# EAGLE design Wiegand_RF (EAGLE 7.2.0)
Assembly variants: minimal
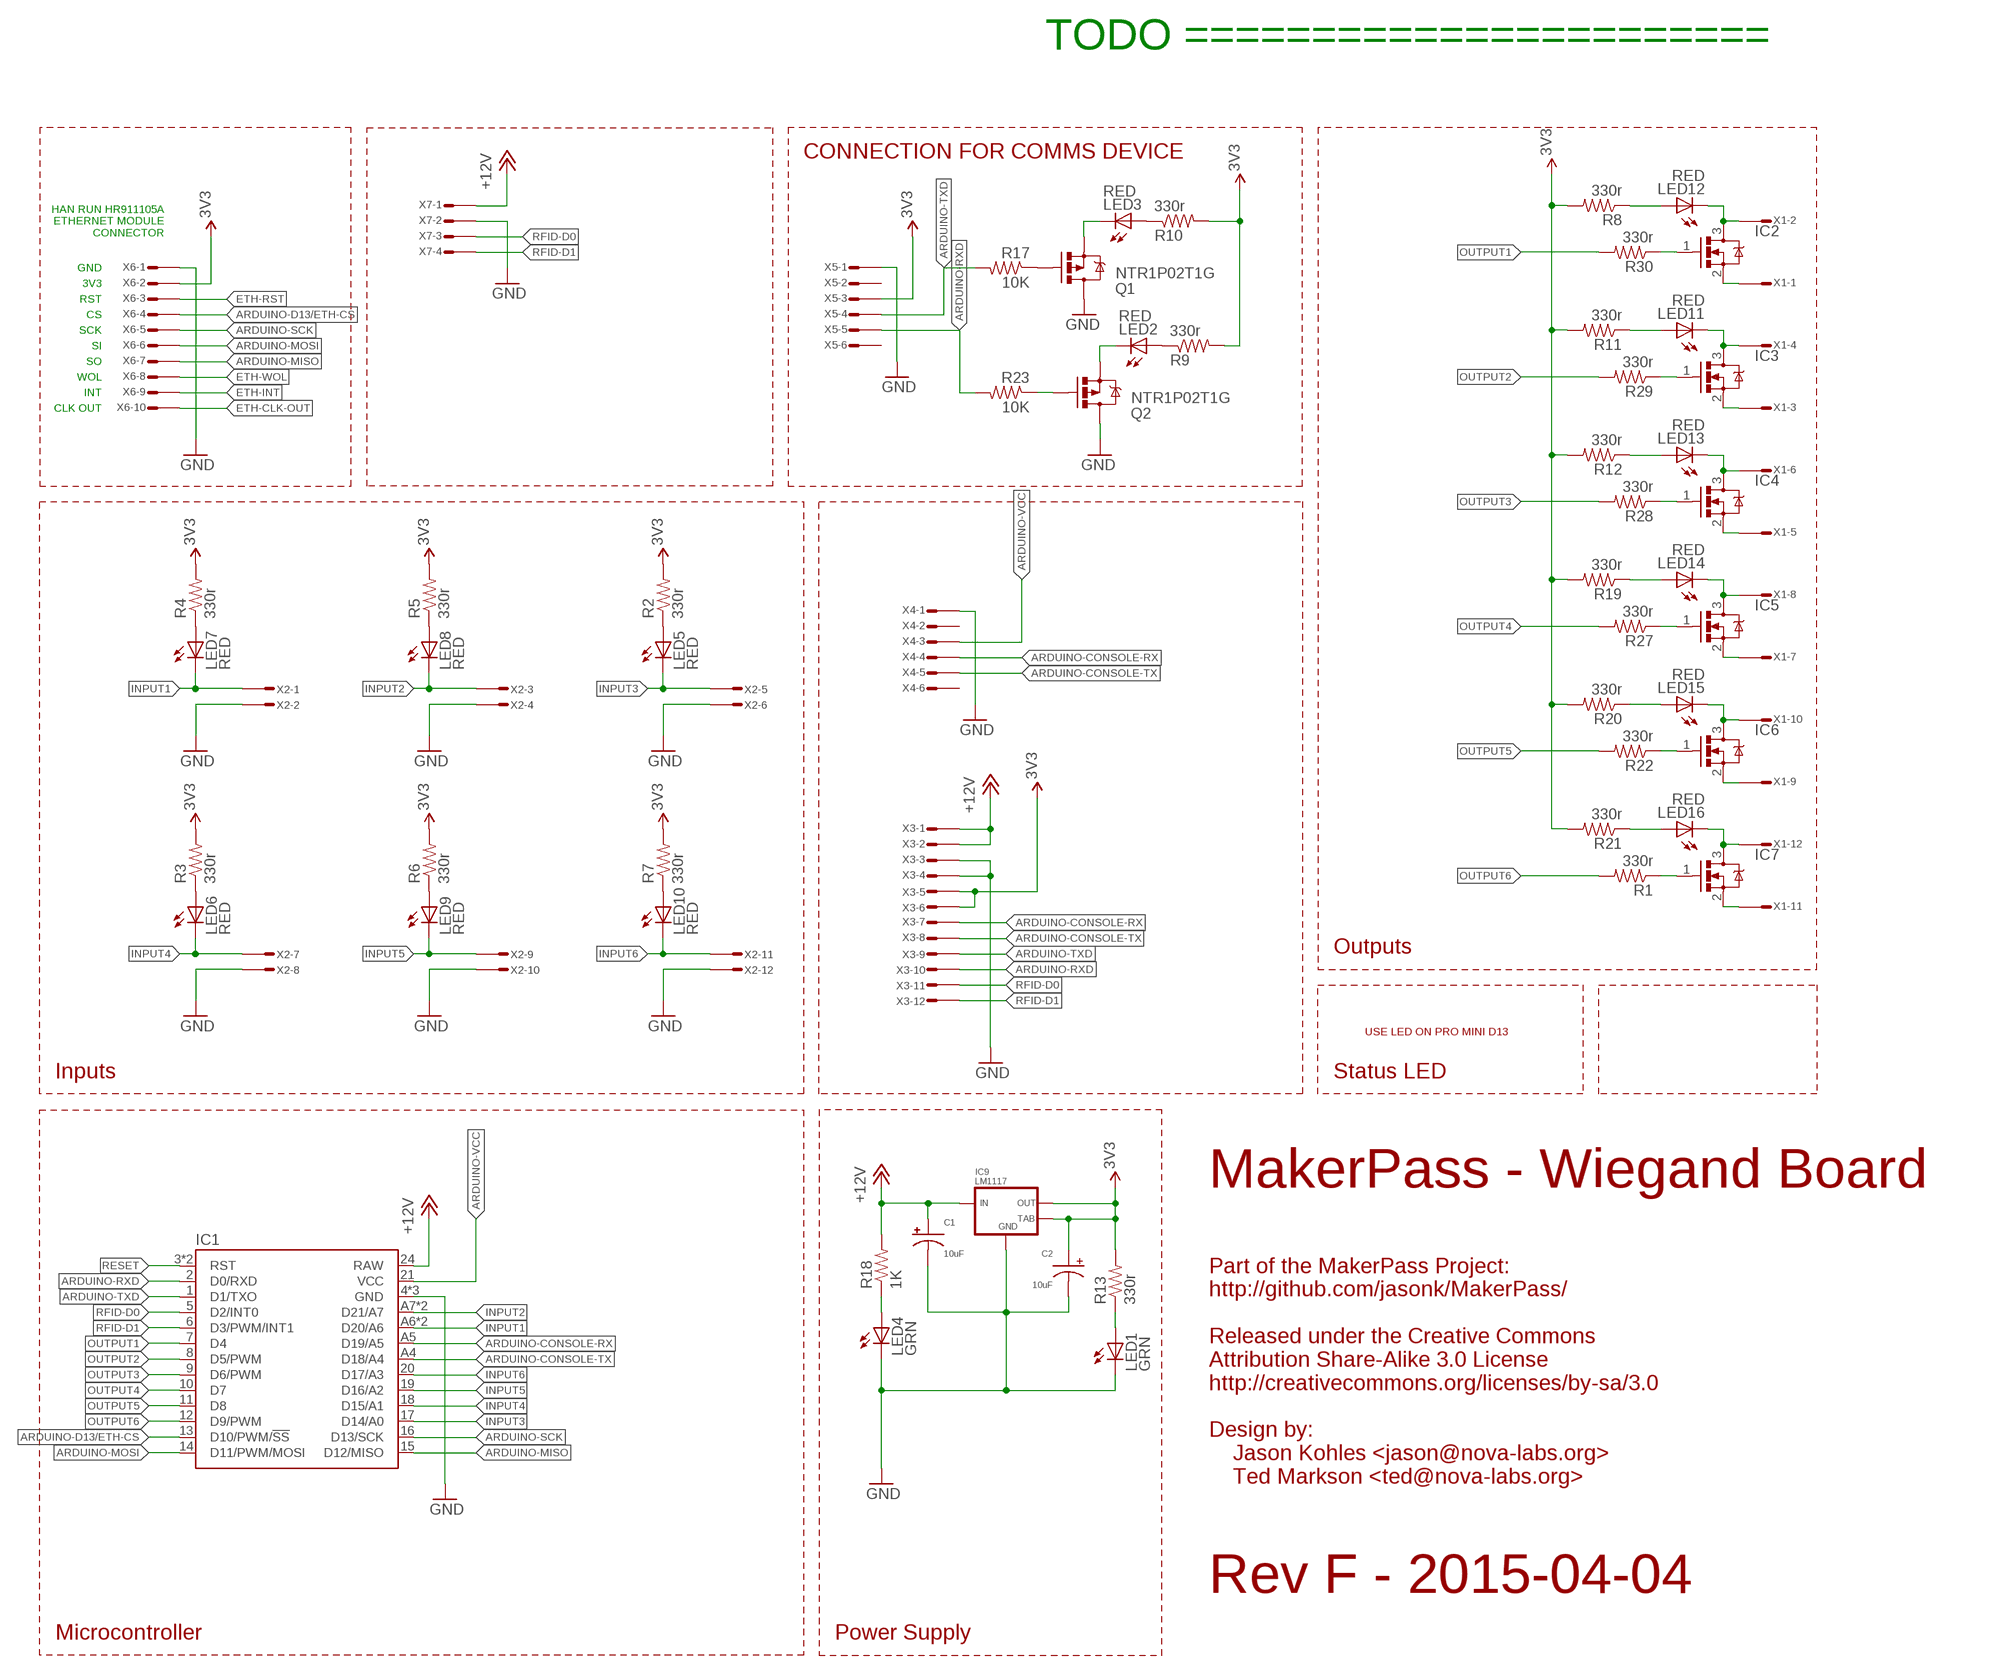
[diagram p0: schematic, sheet 1]

## Parts
C1  10uF  C-POL-CAN-4.3  [C-CAN-4.3]
C2  10uF  C-POL-CAN-4.3  [C-CAN-4.3]
IC1  ARDUINO-PRO-MINI-ALIEXPRESS  [ARDUINO-PRO-MINI-ALIEXPRESS]
IC2  MOSFET-NCHANNEL-SOT23  [SOT23]
IC3  MOSFET-NCHANNEL-SOT23  [SOT23]
IC4  MOSFET-NCHANNEL-SOT23  [SOT23]
IC5  MOSFET-NCHANNEL-SOT23  [SOT23]
IC6  MOSFET-NCHANNEL-SOT23  [SOT23]
IC7  MOSFET-NCHANNEL-SOT23  [SOT23]
IC9  LM1117  VREG-LD1117-SOT223  [SOT223]
LED1  GRN  LED-0805  [LED-805]  (not fitted in variant minimal)
LED2  RED  LED-0805  [LED-805]  (not fitted in variant minimal)
LED3  RED  LED-0805  [LED-805]  (not fitted in variant minimal)
LED4  GRN  LED-0805  [LED-805]  (not fitted in variant minimal)
LED5  RED  LED-0805  [LED-805]  (not fitted in variant minimal)
LED6  RED  LED-0805  [LED-805]  (not fitted in variant minimal)
LED7  RED  LED-0805  [LED-805]  (not fitted in variant minimal)
LED8  RED  LED-0805  [LED-805]  (not fitted in variant minimal)
LED9  RED  LED-0805  [LED-805]  (not fitted in variant minimal)
LED10  RED  LED-0805  [LED-805]  (not fitted in variant minimal)
LED11  RED  LED-0805  [LED-805]  (not fitted in variant minimal)
LED12  RED  LED-0805  [LED-805]  (not fitted in variant minimal)
LED13  RED  LED-0805  [LED-805]  (not fitted in variant minimal)
LED14  RED  LED-0805  [LED-805]  (not fitted in variant minimal)
LED15  RED  LED-0805  [LED-805]  (not fitted in variant minimal)
LED16  RED  LED-0805  [LED-805]  (not fitted in variant minimal)
Q1  NTR1P02T1G  MOSFET-PCHANNELSMD  [SOT23-3]  (not fitted in variant minimal)
Q2  NTR1P02T1G  MOSFET-PCHANNELSMD  [SOT23-3]  (not fitted in variant minimal)
R1  330r  RESISTOR0603-RES  [0603-RES]  (not fitted in variant minimal)
R2  330r  RESISTOR0603-RES  [0603-RES]  (not fitted in variant minimal)
R3  330r  RESISTOR0603-RES  [0603-RES]  (not fitted in variant minimal)
R4  330r  RESISTOR0603-RES  [0603-RES]  (not fitted in variant minimal)
R5  330r  RESISTOR0603-RES  [0603-RES]  (not fitted in variant minimal)
R6  330r  RESISTOR0603-RES  [0603-RES]  (not fitted in variant minimal)
R7  330r  RESISTOR0603-RES  [0603-RES]  (not fitted in variant minimal)
R8  330r  RESISTOR0603-RES  [0603-RES]  (not fitted in variant minimal)
R9  330r  RESISTOR0603-RES  [0603-RES]  (not fitted in variant minimal)
R10  330r  RESISTOR0603-RES  [0603-RES]  (not fitted in variant minimal)
R11  330r  RESISTOR0603-RES  [0603-RES]  (not fitted in variant minimal)
R12  330r  RESISTOR0603-RES  [0603-RES]  (not fitted in variant minimal)
R13  330r  RESISTOR0603-RES  [0603-RES]  (not fitted in variant minimal)
R17  10K  RESISTOR0603-RES  [0603-RES]
R18  1K  RESISTOR0603-RES  [0603-RES]  (not fitted in variant minimal)
R19  330r  RESISTOR0603-RES  [0603-RES]
R20  330r  RESISTOR0603-RES  [0603-RES]
R21  330r  RESISTOR0603-RES  [0603-RES]
R22  330r  RESISTOR0603-RES  [0603-RES]
R23  10K  RESISTOR0603-RES  [0603-RES]
R27  330r  RESISTOR0603-RES  [0603-RES]
R28  330r  RESISTOR0603-RES  [0603-RES]
R29  330r  RESISTOR0603-RES  [0603-RES]
R30  330r  RESISTOR0603-RES  [0603-RES]
X1  CON-1X12-TERMBLOCK-3.5MM  [CON-1X12-TERMBLOCK-3.5MM]
X2  CON-1X12-TERMBLOCK-3.5MM  [CON-1X12-TERMBLOCK-3.5MM]
X3  CON-1X12-TERMBLOCK-3.5MM  [CON-1X12-TERMBLOCK-3.5MM]
X4  CON-1X6-FTDI-AVR  [CON-1X6-FTDI-AVR]
X5  CON-1X6-FTDI-AVR  [CON-1X6-FTDI-AVR]
X6  CON-2X5  [CON-2X5]
X7  CON-1X4  [CON-1X4]

## Nets
3V3: C2.+ IC9.OUT IC9.TAB R2.2 R3.2 R4.2 R5.2 R6.2 R7.2 R8.2 R9.2 R10.2 R11.2 R12.2 R13.2 R19.2 R20.2 R21.2 X3.5 X3.6 X5.3 X6.2
+12V [power]: C1.+ IC1.24(RAW) IC9.IN R18.2 X3.1 X3.2 X7.1
ARDUINO-CONSOLE-RX: IC1.A5(D19/A5) X3.7 X4.4
ARDUINO-CONSOLE-TX: IC1.A4(D18/A4) X3.8 X4.5
ARDUINO-D13/ETH-CS: IC1.13(D10/PWM/!SS) X6.4
ARDUINO-MISO: IC1.15(D12/MISO) X6.7
ARDUINO-MOSI: IC1.14(D11/PWM/MOSI) X6.6
ARDUINO-RXD: IC1.2(D0/RXD) R23.2 X3.10 X5.5
ARDUINO-SCK: IC1.16(D13/SCK) X6.5
ARDUINO-TXD: IC1.1(D1/TXO) R17.2 X3.9 X5.4
ARDUINO-VCC: IC1.21(VCC) X4.3
ETH-CLK-OUT: X6.10
ETH-INT: X6.9
ETH-RST: X6.3
ETH-WOL: X6.8
GND: C1.- C2.- IC1.4(GND) IC1.23(GND) IC1.25(GND) IC9.GND LED1.C LED4.C Q1.3(D) Q2.3(D) X2.2 X2.4 X2.6 X2.8 X2.10 X2.12 X3.3 X3.4 X4.1 X5.1 X6.1 X7.2
INPUT1: IC1.A6(D20/A6) IC1.A6@2(D20/A6) LED7.C X2.1
INPUT2: IC1.A7(D21/A7) IC1.A7@2(D21/A7) LED8.C X2.3
INPUT3: IC1.17(D14/A0) LED5.C X2.5
INPUT4: IC1.18(D15/A1) LED6.C X2.7
INPUT5: IC1.19(D16/A2) LED9.C X2.9
INPUT6: IC1.20(D17/A3) LED10.C X2.11
N$1: LED1.A R13.1
N$3: IC6.2(S) X1.9
N$4: IC6.3(D) LED15.C X1.10
N$5: LED5.A R2.1
N$8: LED4.A R18.1
N$9: LED3.C Q1.2(S)
N$10: LED6.A R3.1
N$11: LED7.A R4.1
N$12: LED8.A R5.1
N$13: LED9.A R6.1
N$14: LED10.A R7.1
N$16: LED12.A R8.1
N$17: IC2.2(S) X1.1
N$18: IC2.3(D) LED12.C X1.2
N$19: IC3.2(S) X1.3
N$20: IC4.3(D) LED13.C X1.6
N$21: LED11.A R11.1
N$23: IC4.2(S) X1.5
N$25: LED13.A R12.1
N$26: LED2.A R9.1
N$27: LED3.A R10.1
N$29: IC5.2(S) X1.7
N$30: IC5.3(D) LED14.C X1.8
N$31: LED14.A R19.1
N$33: LED2.C Q2.2(S)
N$34: Q1.1(G) R17.1
N$35: LED15.A R20.1
N$37: IC7.2(S) X1.11
N$38: IC7.3(D) LED16.C X1.12
N$39: LED16.A R21.1
N$41: IC7.1(G) R1.1
N$42: Q2.1(G) R23.1
N$48: IC2.1(G) R30.1
N$49: IC3.1(G) R29.1
N$50: IC4.1(G) R28.1
N$51: IC5.1(G) R27.1
N$52: IC6.1(G) R22.1
N$53: IC3.3(D) LED11.C X1.4
OUTPUT1: IC1.7(D4) R30.2
OUTPUT2: IC1.8(D5/PWM) R29.2
OUTPUT3: IC1.9(D6/PWM) R28.2
OUTPUT4: IC1.10(D7) R27.2
OUTPUT5: IC1.11(D8) R22.2
OUTPUT6: IC1.12(D9/PWM) R1.2
RESET: IC1.3(RST) IC1.22(RST)
RFID-D0: IC1.5(D2/INT0) X3.11 X7.3
RFID-D1: IC1.6(D3/PWM/INT1) X3.12 X7.4
Unconnected: X4.2 X4.6 X5.2 X5.6

## Notes on the sheet
- TODO =======================
- CONNECTION FOR COMMS DEVICE
- HAN RUN HR911105A
  ETHERNET MODULE
  CONNECTOR
- GND
- 3V3
- RST
- CS
- SCK
- SI
- SO
- WOL
- INT
- CLK OUT
- Outputs
- USE LED ON PRO MINI D13
- Inputs | Status LED
- MakerPass - Wiegand Board
- Part of the MakerPass Project:
  http://github.com/jasonk/MakerPass/
  
  Released under the Creative Commons
  Attribution Share-Alike 3.0 License
  http://creativecommons.org/licenses/by-sa/3.0
  
  Design by:
      Jason Kohles <jason@nova-labs.org>
      Ted Markson <ted@nova-labs.org>
- Rev F - 2015-04-04
- Microcontroller | Power Supply

## Library data of the parts
C1 C2 = Lumisense:C-POL: Capacitors - Polarized 10uF example is part num AVE106M16B12T-F (Digikey 338-1794-1-ND); MFG: UNITED CHEMI-CON; MFG_PN: EMVA250ADA100MD55G; SUPP: DIGIKEY; SUPP_PN: 565-2100-1-ND
IC1 = Lumisense:ARDUINO-PRO-MINI: ARDUINO_PRO_MINI
IC2-IC7 = Lumisense:MOSFET-NCHANNEL: MOSFET-NCHANNEL; MFG: DIODES INC; MFG_PN: DMN6140L-7; SUPP: DIGIKEY; SUPP_PN: DMN6140L-7DICT-ND
IC9 = Lumisense:VREG-LD1117: VREG-LD1117; MFG: TEXAS INSTRUMENTS; MFG_PN: LM1117MPX-3.3/NOPB; SUPP: DIGIKEY; SUPP_PN: LM1117MPX-3.3/NOPBCT-ND
LED1 LED4 = dp_devices:LED: Light Emitting Diode; MFG_PN: LG R971-KN-1
LED2 LED3 LED5-LED16 = dp_devices:LED: Light Emitting Diode; MFG_PN: LY R976-PS-36
Q1 Q2 = SparkFun:MOSFET-PCHANNEL; MFG_PN: NTR1P02T1G
R1-R13 R19-R22 R27-R30 = SparkFun:RESISTOR: Resistor Basic schematic elements and footprints for 0603, 1206, and PTH resistors.; MFG_PN: ERJ3EKF3300V
R17 R23 = SparkFun:RESISTOR: Resistor Basic schematic elements and footprints for 0603, 1206, and PTH resistors.; MFG_PN: ERJ3EKF1002V
R18 = SparkFun:RESISTOR: Resistor Basic schematic elements and footprints for 0603, 1206, and PTH resistors.; MFG_PN: ERJ3EKF1001V
X1-X3 = Lumisense:CON-1X12: CON-1X12; MFG: ON SHORE; MFG_PN: OSTTE120104; SUPP: DIGIKEY; SUPP_PN: ED2737-ND
X4 X5 = Lumisense:CON-1X6: Connector - 1x6 PICKit2 Programming Connector Pinout 1 = VPP/MCLR 2 = VDD Target 3 = VSS (ground) 4 = ICSPDAT/PGD 5 = ICSPCLK/PGC 6 = Auxiliary
X6 = Lumisense:CON-2X5: CON-2x5
X7 = Lumisense:CON-1X4: Connector - 1x4 Receptacle: Digikey WM2002-ND Header: Digikey WM4202-ND header pins: WM1114-ND

## Board
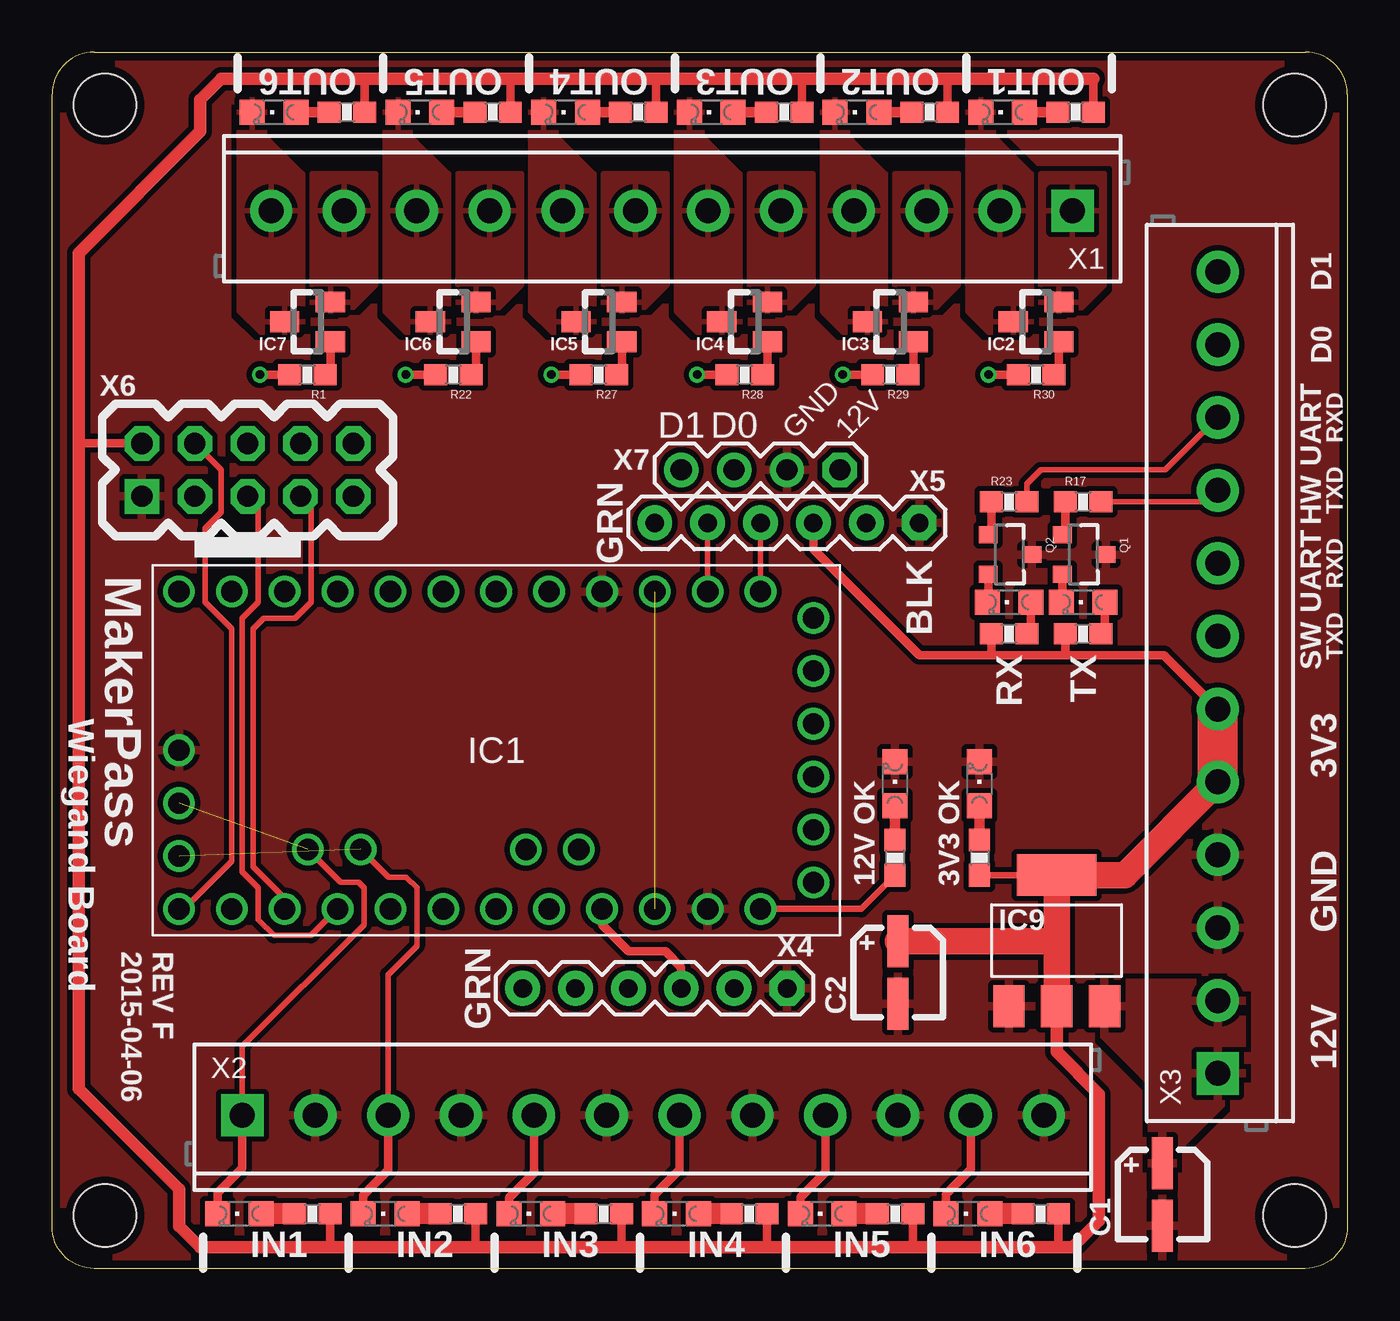
[diagram p1: board, top side]
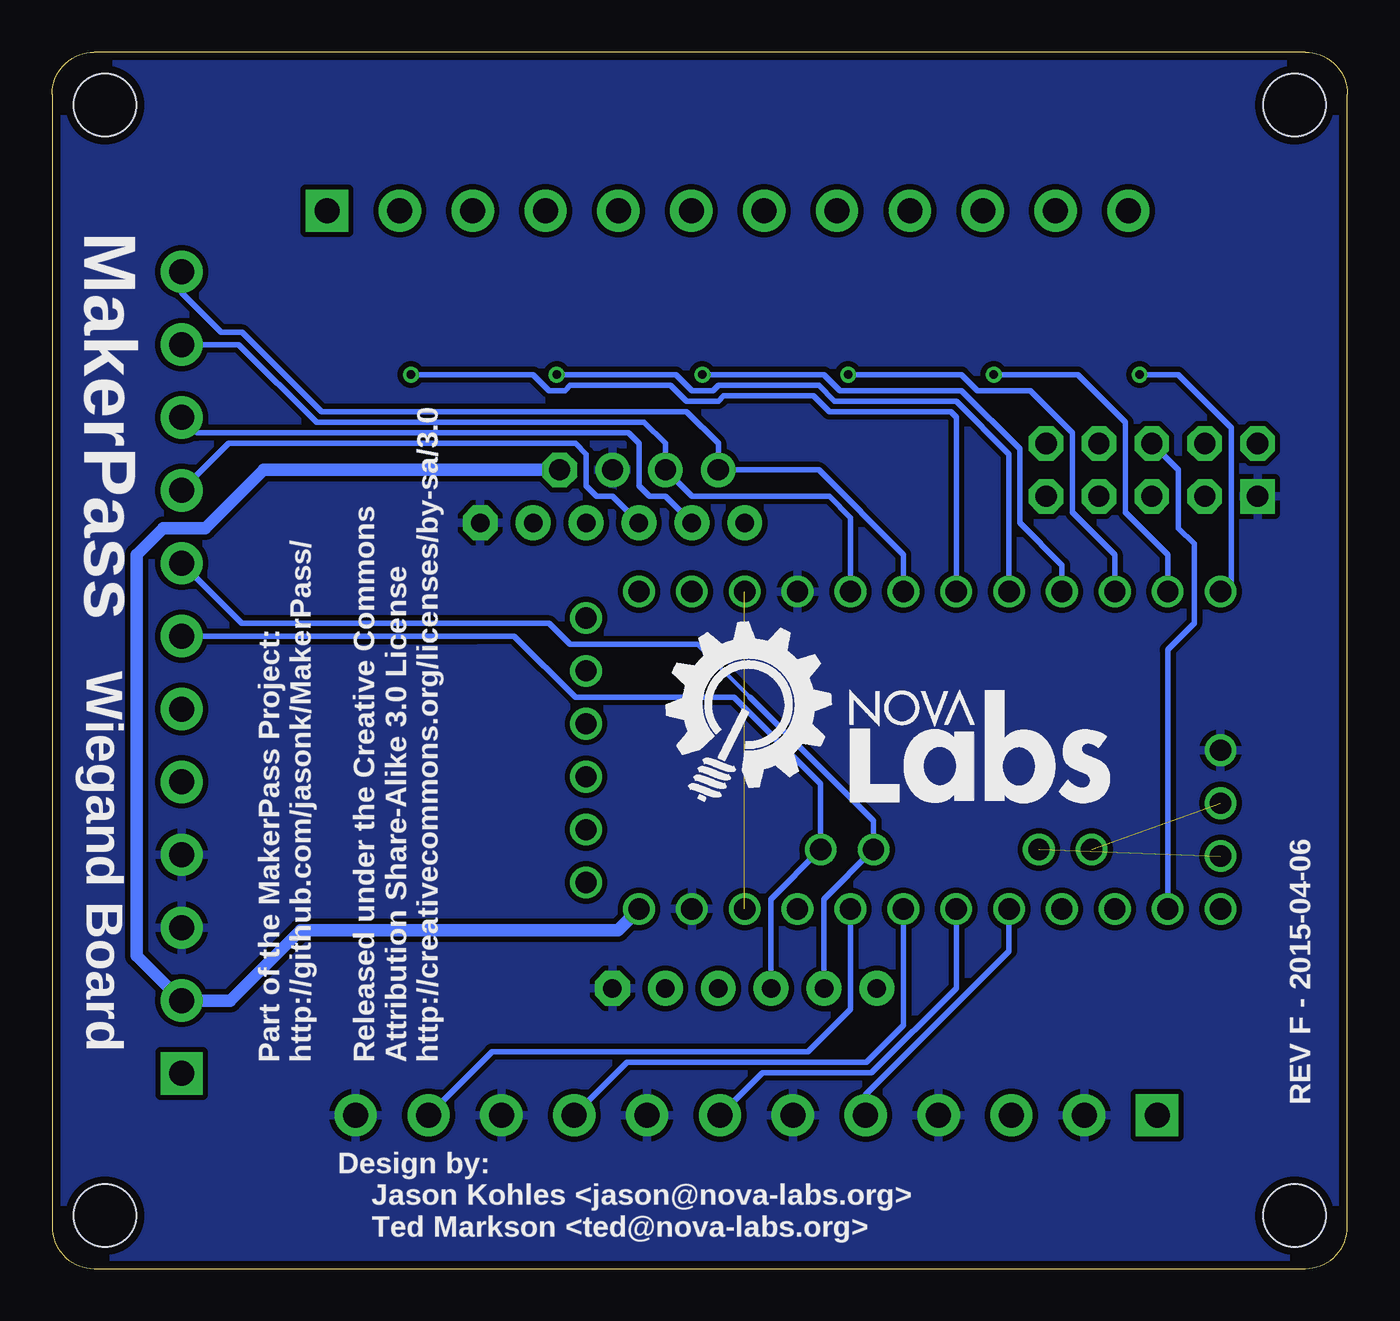
[diagram p2: board, bottom side, seen from below]

Size 62.23 x 58.42 mm. Coordinates in mm from the lower left corner, seen from the top.
Outline: 0,2.03 0,56.39 arc-90 2.03,58.42 60.2,58.42 arc-90 62.23,56.39 62.23,2.03 arc-90 60.2,0 2.03,0 arc-90 0,2.03
Copper layers (1*16): Top 0.0356mm / dielectric 1.5011mm / Bottom 0.0356mm
Design rules "OSHPark": minimum track width 6mil, minimum drill 13mil, track to track 6mil, track to pad 6mil, pad to pad 6mil, via to via 6mil, smd to smd 6mil, copper to edge 15mil, drill to drill 6mil, minimum pad ring 7mil, minimum via ring 7mil, stop-mask expansion 3mil, vias tented up to drill 0mil, thermal gap 10mil
Holes 3 mm at 2.54,2.54 59.69,2.54 2.54,55.88 59.69,55.88
tKeepout: area -0.5,-0.5 to 5.5,5.5; area 56.7,-0.5 to 62.7,5.5; area -0.5,52.9 to 5.5,58.9; area 56.7,52.9 to 62.7,58.9
bKeepout: area -0.5,-0.5 to 5.5,5.5; area 56.7,-0.5 to 62.7,5.5; area -0.5,52.9 to 5.5,58.9; area 56.7,52.9 to 62.7,58.9

### Footprints (pad centres in the part's own frame; a part is rotated, then mirrored left to right if it is on the bottom)
C-CAN-4.3 = smd 2.5 x 1: + 1.5,0; - -1.5,0
ARDUINO-PRO-MINI-ALIEXPRESS = drill 1.016: 1 -7.62,12.7; 2 -7.62,10.16; 3 -7.62,7.62; 4 -7.62,5.08; 5 -7.62,2.54; 6 -7.62,0; 7 -7.62,-2.54; 8 -7.62,-5.08; 9 -7.62,-7.62; 10 -7.62,-10.16; 11 -7.62,-12.7; 12 -7.62,-15.24; 13 7.62,-15.24; 14 7.62,-12.7; 15 7.62,-10.16; 16 7.62,-7.62; 17 7.62,-5.08; 18 7.62,-2.54; 19 7.62,0; 20 7.62,2.54; 21 7.62,5.08; 22 7.62,7.62; 23 7.62,10.16; 24 7.62,12.7; 25 0,-15.24; A4 4.763,1.429; A5 4.763,3.969; A6 2.54,-15.24; A6@2 4.763,-9.049; A7 5.08,-15.24; A7@2 4.763,-6.509; BLK -6.35,15.24; GND -3.81,15.24; GRN 6.35,15.24; RXI 1.27,15.24; TXO 3.81,15.24; VCC -1.27,15.24
SOT23 = smd 1 x 1.4: 1 -0.95,-1.1; 2 0.95,-1.1; 3 0,1.1
SOT223 = smd 1.499 x 2.007: GND -2.301,-3.15; IN 2.301,-3.15; OUT 0,-3.15 | smd 3.81 x 2.007: TAB 0,3.15
LED-805 = smd 1.2 x 1.2: A 0,-1.05; C 0,1.05
SOT23-3 = smd 0.8 x 0.9: 1 -0.95,-1; 2 0.95,-1; 3 0,1.1
0603-RES = smd 1.1 x 1: 1 -0.85,0; 2 0.85,0
CON-1X12-TERMBLOCK-3.5MM = drill 1.2 pad 2.032 square: 1 0,0 | drill 1.2 pad 2.032: 2 3.5,0; 3 7,0; 4 10.5,0; 5 14,0; 6 17.5,0; 7 21,0; 8 24.5,0; 9 28,0; 10 31.5,0; 11 35,0; 12 38.5,0
CON-1X6-FTDI-AVR = drill 0.889 pad 1.676 octagon: 1 0,0 | drill 0.889 pad 1.676: 2 2.54,0; 3 5.08,0; 4 7.62,0; 5 10.16,0; 6 12.7,0
CON-2X5 = drill 1.016 pad 1.651 square: 1 -5.08,-1.27 | drill 1.016 pad 1.651 octagon: 2 -5.08,1.27; 3 -2.54,-1.27; 4 -2.54,1.27; 5 0,-1.27; 6 0,1.27; 7 2.54,-1.27; 8 2.54,1.27; 9 5.08,-1.27; 10 5.08,1.27
CON-1X4 = drill 1.016 pad 1.651 octagon: 1 0,0 | drill 1.016 pad 1.651: 2 2.54,0; 3 5.08,0; 4 7.62,0

### Placement (x,y rotation side)
C1  53.34,3.56 90 top
C2  40.64,14.22 90 top
IC1  21.34,24.89 270 top
IC2  47.27,45.47 90 top
IC3  40.27,45.47 90 top
IC4  33.27,45.47 90 top
IC5  26.27,45.47 90 top
IC6  19.27,45.47 90 top
IC7  12.27,45.47 90 top
IC9  48.26,15.75 0 top
LED1  44.55,23.29 0 top
LED2  45.97,32 90 top
LED3  49.53,32 90 top
LED4  40.49,23.29 0 top
LED5  23,2.63 90 top
LED6  30,2.63 90 top
LED7  9,2.63 90 top
LED8  16,2.63 90 top
LED9  37,2.63 90 top
LED10  44,2.63 90 top
LED11  38.67,55.54 90 top
LED12  45.67,55.54 90 top
LED13  31.67,55.54 90 top
LED14  24.67,55.54 90 top
LED15  17.67,55.54 90 top
LED16  10.67,55.54 90 top
Q1  49.53,34.29 270 top
Q2  45.97,34.29 270 top
R1  12.27,42.93 180 top
R2  26.5,2.63 0 top
R3  33.5,2.63 0 top
R4  12.5,2.63 0 top
R5  19.5,2.63 0 top
R6  40.5,2.63 0 top
R7  47.5,2.63 0 top
R8  49.17,55.54 0 top
R9  45.97,30.48 180 top
R10  49.53,30.48 180 top
R11  42.17,55.54 0 top
R12  35.17,55.54 0 top
R13  44.55,19.73 270 top
R17  49.53,36.83 0 top
R18  40.49,19.73 270 top
R19  28.17,55.54 0 top
R20  21.17,55.54 0 top
R21  14.17,55.54 0 top
R22  19.27,42.93 180 top
R23  45.97,36.83 0 top
R27  26.27,42.93 180 top
R28  33.27,42.93 180 top
R29  40.27,42.93 180 top
R30  47.27,42.93 180 top
U$1  [NOVA-LABS-LOGO-FULL-SMALL]  32.77,22.35 0 bottom
X1  49.02,50.8 180 top
X2  9.14,7.37 0 top
X3  56,9.37 90 top
X4  35.31,13.46 180 top
X5  41.66,35.81 180 top
X6  9.4,38.35 0 top
X7  37.85,38.35 180 top

### Tracks (layer width: path | path; a pad name or v marks a point on that pad's centre or on a via)
3V3
  Top 0.305: R13.2 48.24,18.88 IC9.TAB
  Top 0.406: R7.2 48.35,1.02 | R6.2 41.35,1.02 | R3.2 34.35,1.02 | R2.2 27.35,1.02 | R5.2 20.35,1.02 | R4.2 13.35,1.02 | R21.2 15.02,57.15 | R20.2 22.02,57.15 | R19.2 29.02,57.15 | R12.2 36.02,57.15 | R11.2 43.02,57.15 | R8.2 50.02,57.15 | X3.6 53.41,29.46 48.68,29.46 | R10.2 48.68,29.46 | 48.68,29.46 45.12,29.46 | 45.12,29.46 41.66,29.46 36.58,34.54 X5.3 | R9.2 45.12,29.46 | X6.2 1.27,39.62
  Top 0.61: 50.02,57.15 43.02,57.15 36.02,57.15 29.02,57.15 22.02,57.15 15.02,57.15 8.13,57.15 7.11,56.13 7.11,54.61 1.27,48.77 1.27,39.62 1.27,8.64 6.1,3.81 6.1,2.03 7.11,1.02 13.35,1.02 20.35,1.02 27.35,1.02 34.35,1.02 41.35,1.02 48.35,1.02 49.02,1.02 50.29,2.29 50.29,8.38 48.26,10.41 IC9.OUT
  Top 1.27: IC9.OUT 48.26,15.75 | 48.26,15.75 IC9.TAB 51.53,18.9 X3.5 | C2.+ 48.24,15.72 48.26,15.75
  Top 1.93: X3.5 X3.6
+12V
  Top 0.305: R18.2 38.88,17.27 IC1.24
  Bottom 0.61: IC1.24 35.05,16.26 50.29,16.26 53.68,12.87 X3.2 58.17,15.03 58.17,34.29 56.9,35.56 54.86,35.56 52.07,38.35 X7.1
  pour Top (isolate 0.61): 50.04,13.72 56.64,13.72 57.15,13.21 57.15,8.89 53.85,5.59 53.85,4.06 52.83,4.06 52.83,8.89 50.04,11.68
ARDUINO-CONSOLE-RX
  Bottom 0.254: X4.4 27.69,17.75 IC1.A5 25.3,23.27 26.92,24.89 29.46,27.43 37.08,27.43 40.02,30.37 41.8,30.37 X3.7
ARDUINO-CONSOLE-TX
  Bottom 0.203: 28.7,27.43 31.24,29.97
  Bottom 0.254: X4.5 25.15,17.75 IC1.A4 22.77,21.5 28.7,27.43 | X3.8 53.12,30.99 41.66,30.99 38.35,30.99 37.34,29.97 31.24,29.97
ARDUINO-D13/ETH-CS
  Top 0.254: IC1.13 6.35,17.27 8.64,19.56 8.64,30.73 7.37,32 7.37,35.56 8.13,36.32 8.13,38.35 X6.4
ARDUINO-MISO
  Top 0.254: IC1.15 11.18,17.78 9.65,19.3 9.65,30.73 10.16,31.24 11.68,31.24 12.45,32 12.45,36.58 X6.7
ARDUINO-MOSI
  Bottom 0.254: X6.6 8.13,38.35 8.13,35.56 7.37,34.8 7.37,30.99 8.64,29.72 IC1.14
ARDUINO-RXD
  Top 0.254: X5.5 IC1.2 | R23.2 46.82,37.68 47.5,38.35 53.49,38.35 X3.10
  Bottom 0.254: X5.5 32.77,37.08 33.53,37.08 34.04,37.59 34.04,39.62 34.54,40.13 55.26,40.13 X3.10
ARDUINO-SCK
  Top 0.254: IC1.16 12.45,16 10.67,16 9.91,16.76 9.91,18.29 9.14,19.05 9.14,31.24 9.91,32 9.91,36.58 X6.5
ARDUINO-TXD
  Top 0.254: X5.4 IC1.1 | R17.2 55.46,36.83 X3.9
  Bottom 0.254: X5.4 35.31,37.08 36.07,37.08 36.58,37.59 36.58,39.12 37.08,39.62 53.75,39.62 X3.9
ARDUINO-VCC
  Top 0.406: IC1.21 26.42,16.51 27.69,15.24 29.46,15.24 30.23,14.48 X4.3
GND
  pour Top (isolate 0.254, rank 6): 0,0 62.23,0 62.23,58.42 0,58.42
  pour Bottom (isolate 0.254): 0,0 62.23,0 62.23,58.42 0,58.42
INPUT1  (1 unrouted)
  Top 0.254: IC1.A6@2 13.88,18.54 14.73,18.54 14.99,18.29 14.99,16.51 9.14,10.67 X2.1
  Top 0.406: X2.1 9.14,4.83 7.95,3.63 LED7.C
INPUT2  (1 unrouted)
  Top 0.254: IC1.A7@2 16.16,18.8 17.02,18.8 17.53,18.29 17.53,15.49 16.14,14.11 X2.3
  Top 0.406: X2.3 16.14,4.71 14.95,3.52 LED8.C
INPUT3
  Top 0.406: X2.5 23.14,4.6 21.95,3.41 LED5.C
  Bottom 0.254: IC1.17 16.26,15.24 23.14,8.35 X2.5
INPUT4
  Top 0.406: X2.7 30.14,4.74 28.95,3.55 LED6.C
  Bottom 0.254: IC1.18 18.8,13.46 22.86,9.4 28.11,9.4 X2.7
INPUT5
  Top 0.406: X2.9 37.14,4.63 35.95,3.44 LED9.C
  Bottom 0.254: IC1.19 21.34,11.68 23.11,9.91 34.6,9.91 X2.9
INPUT6
  Top 0.406: X2.11 44.14,4.77 42.95,3.58 LED10.C
  Bottom 0.254: IC1.20 23.88,12.45 25.91,10.41 41.1,10.41 X2.11
N$1
  Top 0.508: LED1.A R13.1
N$3
  pour Top: 19.5,52.58 22.55,52.58 22.55,47.24 21.28,45.97 19.5,45.97
N$4
  pour Top: 16,45.97 16,56.08 15.94,56.13 17.21,56.13 17.21,54.36 18.99,52.58 19.05,52.58 19.05,44.96 17.01,44.96
N$5
  Top 1.016: R2.1 LED5.A
N$8
  Top 0.508: R18.1 LED4.A
N$9
  Top 0.406: LED3.C 48.53,32.05 Q1.2
N$10
  Top 1.016: R3.1 LED6.A
N$11
  Top 1.016: R4.1 LED7.A
N$12
  Top 1.016: R5.1 LED8.A
N$13
  Top 1.016: R6.1 LED9.A
N$14
  Top 1.016: R7.1 LED10.A
N$16
  Top 0.508: LED12.A R8.1
N$17
  pour Top: 47.5,52.58 50.55,52.58 50.55,47.24 49.28,45.97 47.5,45.97
N$18
  pour Top: 44,45.97 44,56.08 43.94,56.13 45.21,56.13 45.21,54.36 46.99,52.58 47.05,52.58 47.05,44.96 45.01,44.96
N$19
  pour Top: 40.5,52.58 43.55,52.58 43.55,47.24 42.28,45.97 40.5,45.97
N$20
  pour Top: 30,45.97 30,56.08 29.94,56.13 31.21,56.13 31.21,54.36 32.99,52.58 33.05,52.58 33.05,44.96 31.01,44.96
N$21
  Top 0.508: LED11.A R11.1
N$23
  pour Top: 33.5,52.58 36.55,52.58 36.55,47.24 35.28,45.97 33.5,45.97
N$25
  Top 0.508: R12.1 LED13.A
N$26
  Top 0.406: R9.1 47.02,30.68 LED2.A
N$27
  Top 0.406: R10.1 50.58,30.68 LED3.A
N$29
  pour Top: 26.5,52.58 29.55,52.58 29.55,47.24 28.28,45.97 26.5,45.97
N$30
  pour Top: 23,45.97 23,56.08 22.94,56.13 24.21,56.13 24.21,54.36 25.99,52.58 26.05,52.58 26.05,44.96 24.01,44.96
N$31
  Top 0.508: LED14.A R19.1
N$33
  Top 0.406: LED2.C 44.97,32.05 Q2.2
N$34
  Top 0.406: Q1.1 48.68,35.39 R17.1
N$35
  Top 0.508: LED15.A R20.1
N$37
  pour Top: 12.5,52.58 15.55,52.58 15.55,47.24 14.28,45.97 12.5,45.97
N$38
  pour Top: 9,45.97 9,56.08 8.94,56.13 10.21,56.13 10.21,54.36 11.99,52.58 12.05,52.58 12.05,44.96 10.01,44.96
N$39
  Top 0.508: LED16.A R21.1
N$41
  Top 0.406: R1.1 13.37,42.93 IC7.1
N$42
  Top 0.406: Q2.1 45.12,35.39 R23.1
N$48
  Top 0.406: R30.1 48.37,42.93 IC2.1
N$49
  Top 0.406: R29.1 41.37,42.93 IC3.1
N$50
  Top 0.406: R28.1 34.37,42.93 IC4.1
N$51
  Top 0.406: R27.1 27.37,42.93 IC5.1
N$52
  Top 0.406: R22.1 20.37,42.93 IC6.1
N$53
  pour Top: 37,45.97 37,56.08 36.94,56.13 38.21,56.13 38.21,54.36 39.99,52.58 40.05,52.58 40.05,44.96 38.01,44.96
OUTPUT1  (via drill 0.41)
  Top 0.406: R30.2 v44.99,42.93
  Bottom 0.254: IC1.7 18.8,40.89 19.05,41.15 24.89,41.15 25.65,41.91 29.97,41.91 30.23,41.66 31.75,41.66 32.51,42.42 37.34,42.42 37.59,42.16 38.35,42.16 39.12,42.93 v44.99,42.93
OUTPUT2  (via drill 0.41)
  Top 0.406: R29.2 v37.99,42.93
  Bottom 0.254: IC1.8 16.26,39.12 18.8,41.66 24.64,41.66 25.4,42.42 30.23,42.42 30.48,42.16 31.5,42.16 32.26,42.93 v37.99,42.93
OUTPUT3  (via drill 0.41)
  Top 0.406: R28.2 v30.99,42.93
  Bottom 0.254: IC1.9 13.72,33.78 15.75,35.81 15.75,39.37 18.54,42.16 24.38,42.16 25.15,42.93 v30.99,42.93
OUTPUT4  (via drill 0.41)
  Top 0.406: R27.2 v23.99,42.93
  Bottom 0.254: IC1.10 11.18,34.29 13.21,36.32 13.21,40.13 15.24,42.16 17.78,42.16 18.54,42.93 v23.99,42.93
OUTPUT5  (via drill 0.41)
  Top 0.406: v16.99,42.93 R22.2
  Bottom 0.254: IC1.11 8.64,34.29 10.67,36.32 10.67,40.64 12.95,42.93 v16.99,42.93
OUTPUT6  (via drill 0.41)
  Top 0.406: v9.99,42.93 R1.2
  Bottom 0.254: IC1.12 5.59,33.02 5.59,40.39 8.13,42.93 v9.99,42.93
RESET  (1 unrouted)
RFID-D0
  Bottom 0.254: X3.11 53.26,44.37 49.53,40.64 33.78,40.64 32.77,39.62 X7.3 31.5,37.08 24.89,37.08 23.88,36.07 IC1.5
RFID-D1
  Bottom 0.254: IC1.6 21.34,34.29 25.4,38.35 X7.4 30.23,39.62 31.75,41.15 49.28,41.15 53.09,44.96 54.1,44.96 56,46.86 X3.12

### Text on the board
tPlace: D1 | D0 | GND | 12V
bPlace: Wiegand Board
tNames: OUT6 | OUT5 | OUT4 | OUT3 | OUT2 | OUT1 | D1 | D0 | RXD | HW UART | TXD | GRN | BLK | RXD | MakerPass | SW UART | TXD | RX | TX | Wiegand Board | 3V3 | 12V OK | 3V3 OK | GND | REV F / 2015-04-06 | GRN | 12V | IN1 | IN2 | IN3 | IN4 | IN5 | IN6
bNames: MakerPass | Part of the MakerPass Project: / http://github.com/jasonk/MakerPass/ / / Released under the Creative Commons / Attribution Share-Alike 3.0 License / http://creativecommons.org/licenses/by-sa/3.0 | REV F - 2015-04-06 | Design by: / Jason Kohles <jason@nova-labs.org> / Ted Markson <ted@nova-labs.org>